# EAGLE schematic TDA2004 (EAGLE 9.5.1)
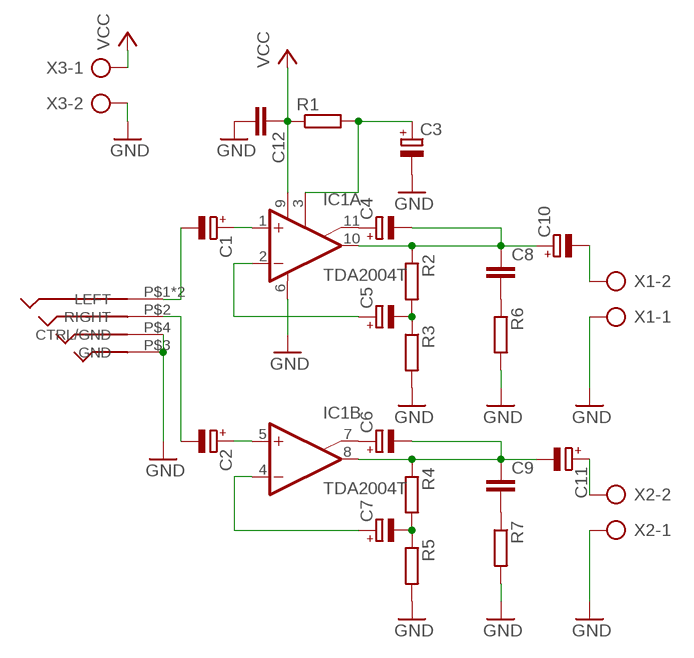
[diagram p0: schematic, sheet 1]

## Parts
C1  CPOL-EUE2-5  [E2-5]
C2  CPOL-EUE2-5  [E2-5]
C3  CPOL-EUE2-5  [E2-5]
C4  CPOL-EUE2-5  [E2-5]
C5  CPOL-EUE25-10AXIAL  [E25-10]
C6  CPOL-EUE2-5  [E2-5]
C7  CPOL-EUE25-10AXIAL  [E25-10]
C8  C-EU050-025X075  [C050-025X075]
C9  C-EU050-025X075  [C050-025X075]
C10  CPOL-EUE5-13  [E5-13]
C11  CPOL-EUE5-13  [E5-13]
C12  C-EU050-025X075  [C050-025X075]
IC1  TDA2004T  [SIP11]
R1  R-EU_0411/15  [0411/15]
R2  R-EU_0411/15  [0411/15]
R3  R-EU_0411/15  [0411/15]
R4  R-EU_0411/15  [0411/15]
R5  R-EU_0411/15  [0411/15]
R6  R-EU_0411/15  [0411/15]
R7  R-EU_0411/15  [0411/15]
U$1  3_5MM_JACK  [3_5MM_JACK]
X1  AK500/2-H  [AK500/2-H]
X2  AK500/2-H  [AK500/2-H]
X3  AK500/2  [AK500/2]

## Nets
GND: C3.- C12.2 IC1.6(A:GND) R3.2 R5.2 R6.2 R7.2 U$1.P$3(GND) U$1.P$4(CTRL/GND) X1.1 X2.1 X3.2
N$1: C5.- R2.2 R3.1
N$2: C7.- R4.2 R5.1
N$3: C8.2 R6.1
N$4: C9.2 R7.1
N$5: C6.+ IC1.7(B:BTSP)
N$6: C3.+ IC1.3(A:SVRR) R1.2
N$7: C4.+ IC1.11(A:BTSP)
N$8: C10.- X1.2
N$9: C5.+ IC1.2(A:-IN)
N$10: C1.+ IC1.1(A:+IN)
N$11: C2.+ IC1.5(B:+IN)
N$12: C7.+ IC1.4(B:-IN)
N$13: C4.- C8.1 C10.+ IC1.10(A:OUT) R2.1
N$14: C6.- C9.1 C11.- IC1.8(B:OUT) R4.1
N$15: C11.+ X2.2
N$16: C1.- U$1.P$1(LEFT) U$1.P$5(LEFT)
N$17: C2.- U$1.P$2(RIGHT)
VCC: C12.1 IC1.9(A:V+) R1.1 X3.1

## Library data of the parts
C1-C7 C10 C11 = rcl:CPOL-EU: POLARIZED CAPACITOR, European symbol; SPICEPREFIX: C
C8 C9 C12 = rcl:C-EU: CAPACITOR, European symbol; SPICEPREFIX: C
IC1 = linear:TDA2004: Power OP AMP
R1-R7 = rcl:R-EU_: RESISTOR, European symbol; SPICEPREFIX: R
U$1 = 35mmJack:3_5MM_JACK
X1 X2 = con-ptr500:AK500/2-H: CONNECTOR Aug. 2004 / PTR Meßtechnik: Die Bezeichnung der Serie AK505 wurde geändert. Es handelt sich hierbei um AK500 in horizontaler Ausführung.; OC_FARNELL: unknown; OC_NEWARK: unknown
X3 = con-ptr500:AK500/2: CONNECTOR; OC_FARNELL: unknown; OC_NEWARK: unknown